# Altium schematic sheet Power.SchDoc: a_card
size A4; Author: 劉東輝; SheetNumber: 4; SheetTotal: 5; Unit: 供电; Edition: V1.5
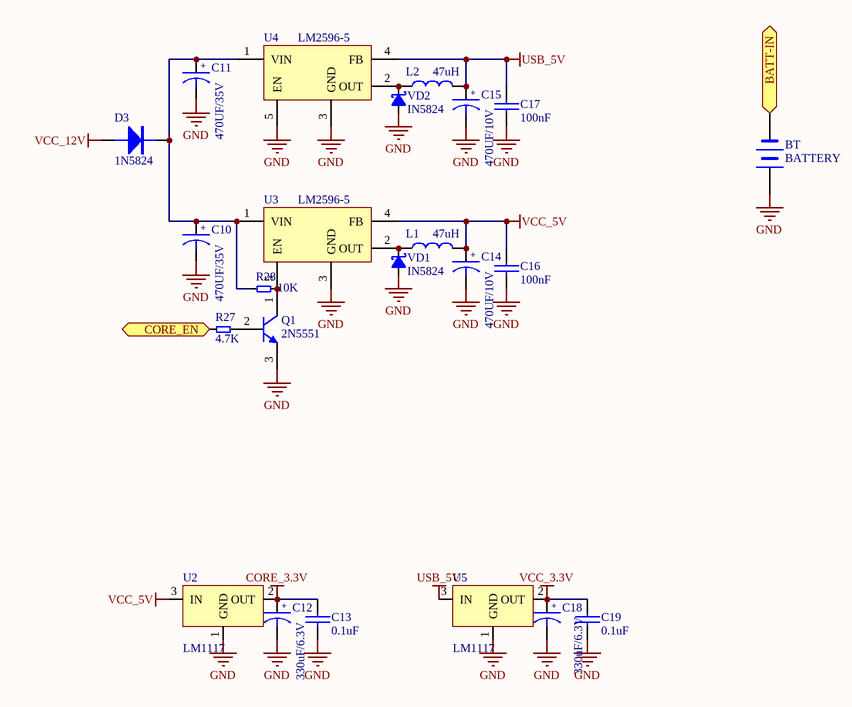
[diagram p0: Power.SchDoc]

## Parts
BT  BATTERY  [CR-1220]
C10  470UF/35V  [SMT_10X10_3-AECAP]
C11  470UF/35V  [SMT_10X10_3-AECAP]
C12  330uF/6.3V  [SMT_6_3X7_7-AECAP]
C13  0.1uF  [0805/2012 C3]
C14  470UF/10V  [SMT_6_3X7_7-AECAP]
C15  470UF/10V  [SMT_6_3X7_7-AECAP]
C16  100nF  [0805/2012 C3]
C17  100nF  [0805/2012 C3]
C18  330uF/6.3V  [SMT_6_3X7_7-AECAP]
C19  0.1uF  [0805/2012 C3]
D3  1N5824  [DO-214AC]
L1  47uH  [MS125]
L2  47uH  [MS125]
Q1  2N5551  [SOT-23 Q2]
R27  4.7K  [0805/2012 R3]
R28  10K  [0805/2012 R3]
U2  LM1117  [SOT-223]
U3  LM2596-5  [TO-263-5]
U4  LM2596-5  [TO-263-5]
U5  LM1117  [SOT-223]
VD1  IN5824  [DO-214AC]
VD2  IN5824  [DO-214AC]

## Ports
BATT-IN (bidir), CORE_EN (bidir)

## Nets
CORE_3.3V: C12.1 C13.1 U2.2(OUT) U2.4(OUT)
GND: BT.1(+) C10.2 C11.2 C12.2 C13.2 C14.2 C15.2 C16.2 C17.2 C18.2 C19.2 Q1.3(E) U2.1(GND) U3.3(GND) U4.3(GND) U4.5(EN) U5.1(GND) VD1.1(A) VD2.1(A)
USB_5V: C15.1 C17.1 L2.1 U4.4(FB) U5.3(IN)
VCC_3.3V: C18.1 C19.1 U5.2(OUT) U5.4
VCC_5V: C14.1 C16.1 L1.1 U2.3(IN) U3.4(FB)
VCC_12V: D3.1(A)
BATT-IN: BT.2(-) ; port BATT-IN
CORE_EN: R27.1 ; port CORE_EN
NetC10_1: C10.1 C11.1 D3.2(K) R28.2 U3.1(VIN) U4.1(VIN)
NetL1_2: L1.2 U3.2(OUT) VD1.2(K)
NetL2_2: L2.2 U4.2(OUT) VD2.2(K)
NetQ1_1: Q1.1(C) R28.1 U3.5(EN)
NetQ1_2: Q1.2(B) R27.2

## Notes on the sheet
- 项目:
- 作者:
- 总张数:
- 页码:
- 日期:
- 单元:
- 版本:
- (in symbol 10UF/10V) +

## Library data of the parts
BT = BATTERY: pin to pad: 1>2 2>1
C10-C12 C14 C15 C18 = 10UF/10V: CCTC-106K010
C13 C19 = Pro39.tmp_22P_32
C16 C17 = Pro39.tmp_22P_32: 104
D3 = 1N5819: CD-1N5819-DO41; pin to pad: 1>2 2>1
L1 L2 = 100UH-SLF7032: 12*12电感
Q1 = NPN: NPN Bipolar Transistor; pin to pad: 1>3 2>1 3>2; Published: 8-Jun-2000; LatestRevisionDate: 17-Jul-2002; LatestRevisionNote: Re-released for DXP Platform.; PackageReference: TO-226-AA; Publisher: Altium Limited; PackageDescription: TO, Flat Index; 3 In-Line, Axial Leads; Body Dia. 4.8mm; Leads 0.55 x 0.51 mm (max); Code_JEDEC: TO-226-AA
R27 R28 = RES2: Resistor
U3 U4 = LM2596: LM2575/2596
VD1 VD2 = DIODE SCHOTTKY: 肖特基; pin to pad: 1>2 2>1